# EasyEDA Pro project ChisFlash-MBC5_GBC烧录卡_shn修改plus图纸nds烧录线路+电池加固通孔.epro, board ChisFlash-MBC5-v1.1
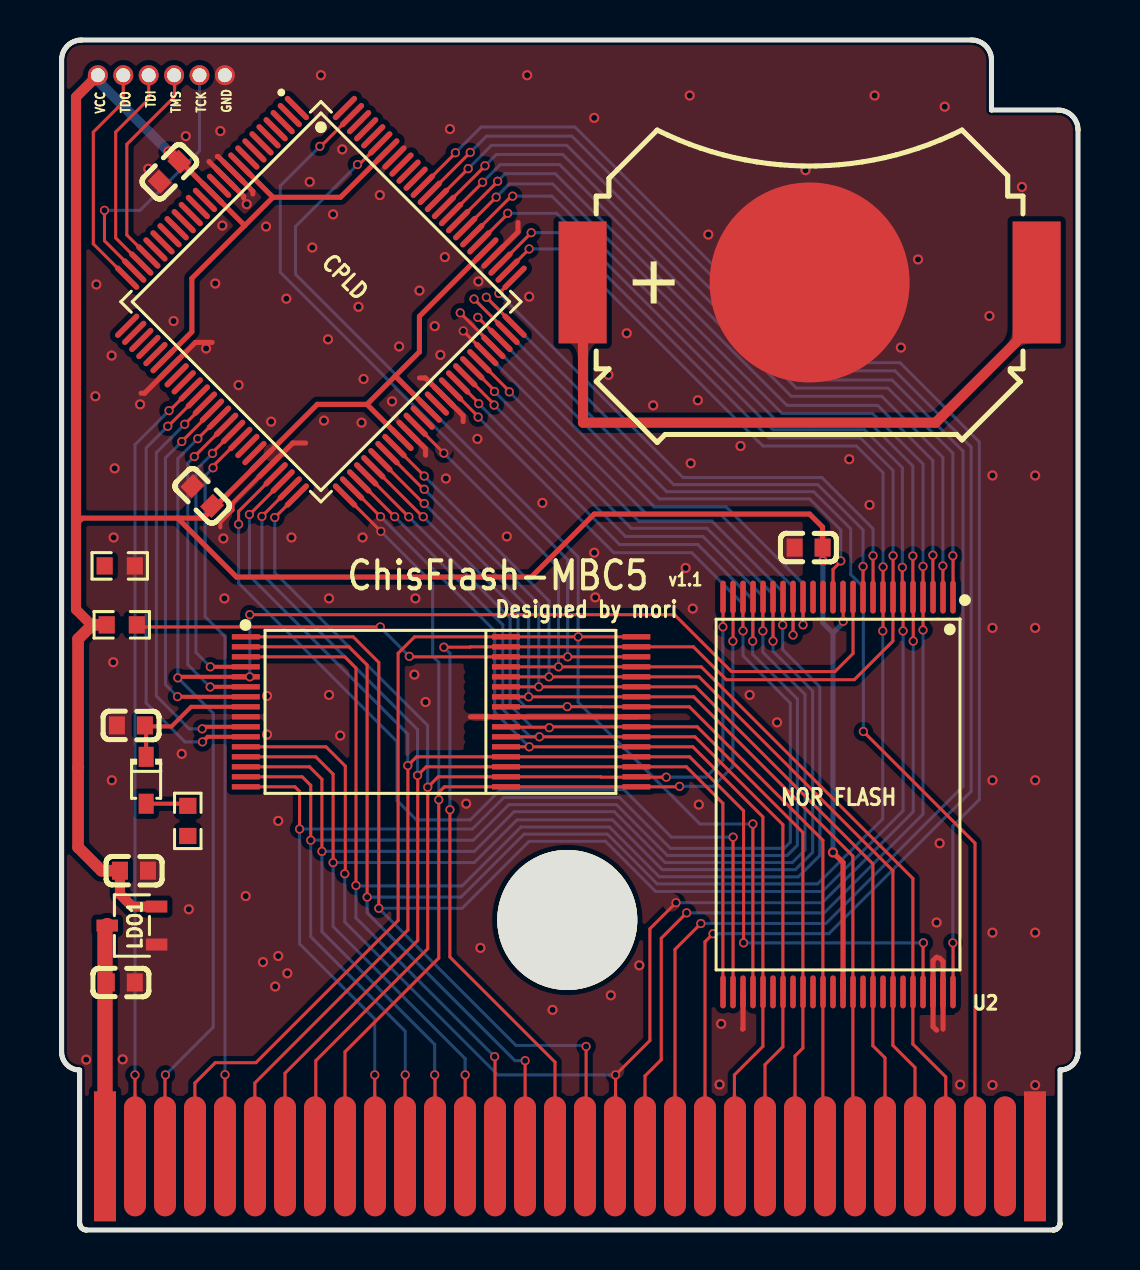
[diagram p2: board, top side]
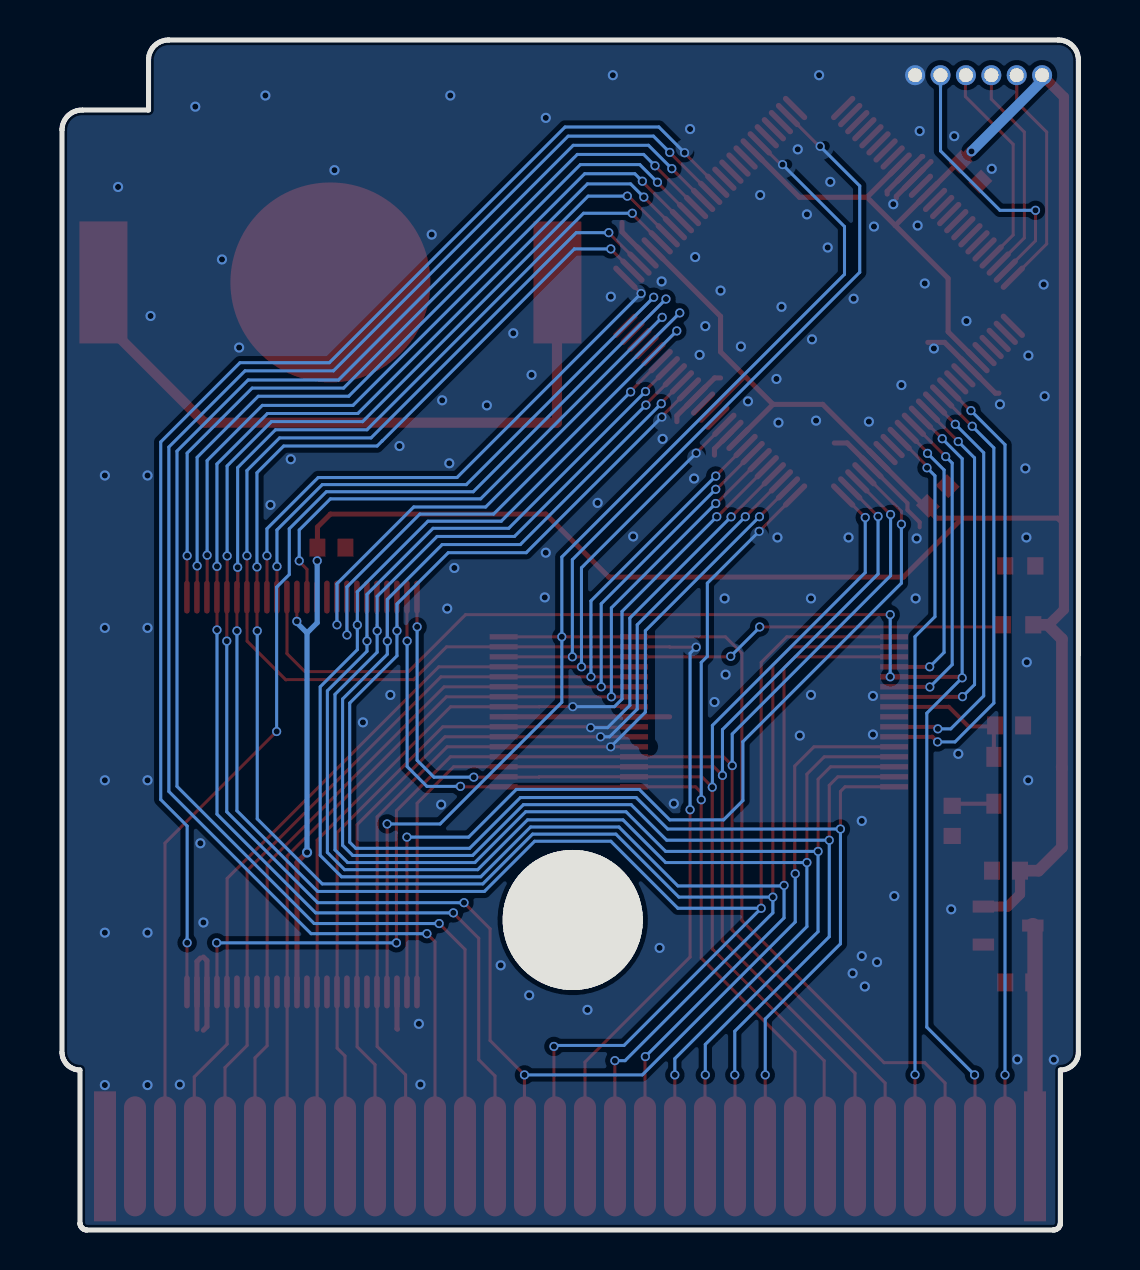
[diagram p3: board, bottom side, seen from below]

Outline 50.82 x 59.5 mm; copper layers: Top Layer, Bottom Layer. Coordinates in mm from the lower left corner of the outline.
Stack: Top Layer 0.035mm / Dielectric1 1.51mm FR4 er 4.5 / Bottom Layer 0.035mm

## Design rules (mm)
template: 自定义配置
spacing copperThickness1oz (default): track to track 0.102, other pairs 0.152 to 0.152
spacing copperThickness2oz: track to track 0.203, other pairs 0.152 to 0.3
track width copperThickness1oz (default): min 0.152, default 0.152, max 2.54
track width copperThickness2oz: min 0.203, default 0.254, max 2.54
differential pair differentialPair (default): width min 0.127, default 0.254, max 2.54; gap min 0.152, default 0.152
via viaSize (default): diameter min 0.406, default 0.457, max 10; hole min 0.3, default 0.305, max 6.299

## Placement (name value [footprint] x y rotation side)
BT1  MY-2032-12  [BAT-SMD_MY-2032-12]  37.4 47.38 180 top
C1  100nF  [C0603]  3.47 25.23 180 top
C2  100nF  [C0603]  37.35 34.12 0 top
C3  10uF  [C0603]  3.62 17.97 180 top
C5  100nF  [C0603]  7.03 36.7 315 top
C6  100nF  [C0603]  5.4 52.92 45 top
C7  10uF  [C0603]  2.96 12.38 180 top
D2  1N4148WS  [SOD-323_L1.8-W1.3-LS2.5-RD]  4.23 22.49 270 top
J1  GAMEBOY-CARTRIDGE-MBC3  [GAMEBOY_CARTRIDGE_PIN]  25.28 15.5 0 top
LDO1  ME6209A33M3G  [SOT-23-3_L2.9-W1.6-P1.90-LS2.8-BR]  3.52 15.22 0 top
R1  100kΩ  [R0603]  2.91 33.21 0 top
R2  10kΩ  [R0603]  6.31 20.46 90 top
R3  10kΩ  [R0603]  3.01 30.26 180 top
U2  MX29LV640ETTI-70G  [TSOP-48_L12.0-W18.4-P0.50-LS20.0-BL]  38.82 21.78 180 top
U4  EPM240T100C5N  [TQFP-100_L14.0-W14.0-P0.50-LS16.0-BL]  12.96 46.42 225 top
U6  SRAM&FRAM  [TSSOP-TSOP二合一]  19.98 25.89 180 top
XP1  JTAG  [HDR-TH_6P-P1.27-V-M-1]  4.99 57.74 0 top

## Footprints (pads in the part's own frame, mm; a bottom-side part is the same pattern mirrored in y, then rotated)
BAT-SMD_MY-2032-12
  rect 2.4x6.1 smd: 1(-11.35,0) 1(11.35,0)
  round 10 smd: 2(0,0)
C0603
  rect 0.8x0.9 smd: 1(-0.7,0) 2(0.7,0)
GAMEBOY_CARTRIDGE_PIN
  round 7 hole 7: 0(0,0)
  rect 1.1x6.5 smd: 1(-23.114,-11.819) 32(23.386,-11.819)
  oval 1.1x6 smd: 2(-21.614,-11.819) 3(-20.114,-11.819) 4(-18.614,-11.819) 5(-17.114,-11.819) 6(-15.614,-11.819) 7(-14.114,-11.819) 8(-12.614,-11.819) 9(-11.114,-11.819) 10(-9.614,-11.819) 11(-8.114,-11.819) 12(-6.614,-11.819) 13(-5.114,-11.819) 14(-3.614,-11.819) 15(-2.114,-11.819) 16(-0.614,-11.819) 17(0.886,-11.819) 18(2.386,-11.819) 19(3.886,-11.819) 20(5.386,-11.819) 21(6.886,-11.819) 22(8.386,-11.819) 23(9.886,-11.819) 24(11.386,-11.819) 25(12.886,-11.819) 26(14.386,-11.819) 27(15.886,-11.819) 28(17.386,-11.819) 29(18.886,-11.819) 30(20.386,-11.819) 31(21.886,-11.819)
HDR-TH_6P-P1.27-V-M-1
  round 1 hole 0.7: 1(-3.175,0) 2(-1.905,0) 3(-0.635,0) 4(0.635,0) 5(1.905,0) 6(3.175,0)
R0603
  rect 0.806x0.864 smd: 1(-0.753,0) 2(0.753,0)
SOD-323_L1.8-W1.3-LS2.5-RD
  rect 1x0.75 smd: 1(-1.173,0) 2(1.173,0)
SOT-23-3_L2.9-W1.6-P1.90-LS2.8-BR
  rect 1.07x0.6 smd: 1(1.235,-0.95) 2(1.235,0.95) 3(-1.235,0)
TQFP-100_L14.0-W14.0-P0.50-LS16.0-BL
  oval 0.28x1.6 smd: 1(-6,-7.7) 2(-5.5,-7.7) 3(-5,-7.7) 4(-4.5,-7.7) 5(-4,-7.7) 6(-3.5,-7.7) 7(-3,-7.7) 8(-2.5,-7.7) 9(-2,-7.7) 10(-1.5,-7.7) 11(-1,-7.7) 12(-0.5,-7.7) 13(0,-7.7) 14(0.5,-7.7) 15(1,-7.7) 16(1.5,-7.7) 17(2,-7.7) 18(2.5,-7.7) 19(3,-7.7) 20(3.5,-7.7) 21(4,-7.7) 22(4.5,-7.7) 23(5,-7.7) 24(5.5,-7.7) 25(6,-7.7) 51(6,7.7) 52(5.5,7.7) 53(5,7.7) 54(4.5,7.7) 55(4,7.7) 56(3.5,7.7) 57(3,7.7) 58(2.5,7.7) 59(2,7.7) 60(1.5,7.7) 61(1,7.7) 62(0.5,7.7) 63(0,7.7) 64(-0.5,7.7) 65(-1,7.7) 66(-1.5,7.7) 67(-2,7.7) 68(-2.5,7.7) 69(-3,7.7) 70(-3.5,7.7) 71(-4,7.7) 72(-4.5,7.7) 73(-5,7.7) 74(-5.5,7.7) 75(-6,7.7)
  oval 1.6x0.28 smd: 26(7.7,-6) 27(7.7,-5.5) 28(7.7,-5) 29(7.7,-4.5) 30(7.7,-4) 31(7.7,-3.5) 32(7.7,-3) 33(7.7,-2.5) 34(7.7,-2) 35(7.7,-1.5) 36(7.7,-1) 37(7.7,-0.5) 38(7.7,0) 39(7.7,0.5) 40(7.7,1) 41(7.7,1.5) 42(7.7,2) 43(7.7,2.5) 44(7.7,3) 45(7.7,3.5) 46(7.7,4) 47(7.7,4.5) 48(7.7,5) 49(7.7,5.5) 50(7.7,6) 76(-7.7,6) 77(-7.7,5.5) 78(-7.7,5) 79(-7.7,4.5) 80(-7.7,4) 81(-7.7,3.5) 82(-7.7,3) 83(-7.7,2.5) 84(-7.7,2) 85(-7.7,1.5) 86(-7.7,1) 87(-7.7,0.5) 88(-7.7,0) 89(-7.7,-0.5) 90(-7.7,-1) 91(-7.7,-1.5) 92(-7.7,-2) 93(-7.7,-2.5) 94(-7.7,-3) 95(-7.7,-3.5) 96(-7.7,-4) 97(-7.7,-4.5) 98(-7.7,-5) 99(-7.7,-5.5) 100(-7.7,-6)
TSOP-48_L12.0-W18.4-P0.50-LS20.0-BL
  oval 0.28x1.65 smd: 1(-5.75,-9.87) 2(-5.25,-9.87) 3(-4.75,-9.87) 4(-4.25,-9.87) 5(-3.75,-9.87) 6(-3.25,-9.87) 7(-2.75,-9.87) 8(-2.25,-9.87) 9(-1.75,-9.87) 10(-1.25,-9.87) 11(-0.75,-9.87) 12(-0.25,-9.87) 13(0.25,-9.87) 14(0.75,-9.87) 15(1.25,-9.87) 16(1.75,-9.87) 17(2.25,-9.87) 18(2.75,-9.87) 19(3.25,-9.87) 20(3.75,-9.87) 21(4.25,-9.87) 22(4.75,-9.87) 23(5.25,-9.87) 24(5.75,-9.87) 25(5.75,9.87) 26(5.25,9.87) 27(4.75,9.87) 28(4.25,9.87) 29(3.75,9.87) 30(3.25,9.87) 31(2.75,9.87) 32(2.25,9.87) 33(1.75,9.87) 34(1.25,9.87) 35(0.75,9.87) 36(0.25,9.87) 37(-0.25,9.87) 38(-0.75,9.87) 39(-1.25,9.87) 40(-1.75,9.87) 41(-2.25,9.87) 42(-2.75,9.87) 43(-3.25,9.87) 44(-3.75,9.87) 45(-4.25,9.87) 46(-4.75,9.87) 47(-5.25,9.87) 48(-5.75,9.87)
TSSOP-TSOP二合一
  rect 1.399x0.27 smd: 1(10.762,-3.769) 2(10.762,-3.269) 3(10.762,-2.769) 4(10.762,-2.269) 5(10.762,-1.769) 6(10.762,-1.269) 7(10.762,-0.769) 8(10.762,-0.269) 9(10.762,0.231) 10(10.762,0.731) 11(10.762,1.231) 12(10.762,1.731) 13(10.762,2.231) 14(10.762,2.731) 15(10.762,3.231) 16(10.762,3.731) 17(-8.763,3.731) 17(-2.243,3.731) 18(-8.763,3.231) 18(-2.243,3.231) 19(-8.763,2.731) 19(-2.243,2.731) 20(-8.763,2.231) 20(-2.243,2.231) 21(-8.763,1.731) 21(-2.243,1.731) 22(-8.763,1.231) 22(-2.243,1.231) 23(-8.763,0.731) 23(-2.243,0.731) 24(-8.763,0.231) 24(-2.243,0.231) 25(-8.763,-0.269) 25(-2.243,-0.269) 26(-8.763,-0.769) 26(-2.243,-0.769) 27(-8.763,-1.269) 27(-2.243,-1.269) 28(-8.763,-1.769) 28(-2.243,-1.769) 29(-8.763,-2.269) 29(-2.243,-2.269) 30(-8.763,-2.769) 30(-2.243,-2.769) 31(-8.763,-3.269) 31(-2.243,-3.269) 32(-8.763,-3.769) 32(-2.243,-3.769)

## Nets
As in the schematic.

Pads without a net: J1 0 31; U4 1 2 3 4 5 6 7 8 12 14 15 16 17 18 19 20 21 26 27 28 29 30 33 34 43 44 62 64 90 91 92 96 97 98 100

## Via types
v1: diameter 0.508, hole 0.305, Top Layer to Bottom Layer, 113 vias
v2: diameter 0.457, hole 0.305, Top Layer to Bottom Layer, 130 vias

## Routing (per net, layer and track width the routed paths; a pad name or vN(x,y) marks a point on that pad's centre or on a via; arc(x,y) is an arc through that point)
+3V3: length 168.9
  Top Layer w0.152: U2.12 39.08,31.64 v2(39.08,30.44)
  Top Layer w0.254: 15.27,41.28 12.78,41.28 U4.45 7.09,35.59 5.8,35.59 ; 15.27,41.28 16.68,42.7 ; 15.27,41.28 U4.59 ; 5.8,35.59 1.04,35.59 0.72,35.28 ; 5.8,35.59 8.75,32.65 23.48,32.65 26.63,35.8 37.4,35.8 38.05,35.15 C2.2 38.06,34.11 v2(38.06,33.46) ; 9.15,50.23 10.57,51.64 ; 9.15,50.23 U4.13 5.97,53.41 C6.2 ; 9.15,50.23 6.51,47.58 6.51,44.91 U4.31 ; 10.57,51.64 13.95,51.64 U4.94 ; 10.57,51.64 U4.9 ; 21.24,49.03 17.89,45.69 17.89,43.91 16.68,42.7 ; v1(38.57,18.88) 39.07,18.38 U2.37 ; 16.68,42.7 U4.63
  Top Layer w0.508: XP1.1 0.72,56.65 0.72,31.02 1.48,30.26 1.54,30.26 ; 0.87,23.15 0.82,23.1 ; C6.2 5.37,53.93 v2(5.34,53.93) ; LDO1.2 3.53,16.17 2.92,16.79 2.92,17.97
  Top Layer w0.584: 1.81,30.26 1.54,30.26 0.82,29.55 0.82,19.14 1.99,17.97 2.92,17.97
  Bottom Layer w0.254: v2(39.08,30.44) 39.08,30.36 38.57,29.85 ; 38.57,29.85 38.06,30.36 v2(38.06,33.46) ; 38.57,29.85 v1(38.57,18.88)
  Bottom Layer w0.508: v2(5.34,53.93) 1.81,57.46 XP1.1
+5V: length 11.6
  Top Layer w0.762: J1.1 2.17,15.11 LDO1.3
GND: length 40.7
  Top Layer w0.203: U4.46 8.55,36.34 8.55,36 7.94,35.39 7.94,35.14
  Top Layer w0.254: U4.60 18.2,39.06 18.2,38.74 ; 9.1,51.6 9.1,51.69 U4.11 7.38,53.42 7.38,53.43 ; 7.78,53.68 7.82,53.68 U4.10 9.56,51.94 9.56,51.8 ; 12.2,39.35 11.56,39.35 U4.46 ; 7.53,44.38 6.69,44.38 U4.32 4.15,41.84 3.97,41.84 ; 43.9,13.6 44.07,13.43 U2.47 44.07,10.04 ; U6.24 20.44,25.66 ; U4.79 22.82,49.91 22.82,50.38 ; 20.08,40.42 20.08,40.72 U4.65 18.19,42.61 17.89,42.61 ; U2.27 34.07,10.07 34.05,10.04 ; 43.75,13.65 43.57,13.47 U2.46 43.57,10.17 43.75,9.99
  vias: v1(1.23,8.52) v1(1.69,41.69) v1(1.74,47.28) v1(2.5,43.72) v1(2.51,22.49) v1(2.6,34.63) v1(2.58,28.39) v1(2.65,38.08) v1(3.05,8.53) v1(3.92,41.28) v1(4.33,53.06) v1(5.6,45.45) v1(6.01,23.81) v1(6.21,54.7) v1(6.36,16.04) v1(7.22,44.08) v1(7.68,47.33) v1(7.94,54.95) v1(8.04,50.23) v1(8.09,34.58) v1(8.14,31.58) v1(8.85,42.25) v1(9.21,16.7) v1(9.26,51.29) v1(10.07,13.4) v1(10.22,50.17) v1(10.27,26.7) v1(10.27,24.77) v1(10.48,40.42) v1(10.68,12.18) v1(10.83,20.46) v1(10.83,13.7) v1(11.24,46.57) v1(11.29,12.84) v1(11.49,34.63) v1(12.41,52.41) v1(12.53,49.13) v1(12.96,57.74) v1(13.12,40.47) v1(13.32,44.54) v1(13.37,31.58) v1(13.37,26.76) v1(13.57,50.78) v1(13.93,24.72) v1(14.03,54.04) v1(14.84,46.16) v1(15,40.37) v1(15.1,42.55) v1(15.05,34.63) v1(15.91,51.75) v1(16.52,41.44) v1(16.88,44.18) v1(17.69,31.58) v1(17.64,27.77) v1(17.89,46.97) v1(18.2,26.4) v1(18.66,45.2) v1(18.94,43.76) v1(19.16,48.65) v1(19.21,37.58) v1(19.42,55.05) v1(20.23,21.32) v1(20.79,39.56) v1(20.84,47.43) v1(20.94,14.11) v1(22.26,34.68) v1(23.28,57.74) v1(23.38,46.67) v1(24.04,36.36) v1(24.55,11.01) v1(26.63,55.61) v1(26.63,33.87) v1(26.68,31.63) v1(27.34,42.76) v1(27.46,11.74) v1(28.26,44.84) v1(28.89,13.23) v1(29.58,41.23) v1(31.2,33.11) v1(31.41,56.73) v1(31.46,38.34) v1(31.56,31.07) v1(31.81,41.49) v1(31.86,21.27) v1(32.34,49.77) v1(32.9,7.27) v1(32.98,10.31) v1(33.95,39.2) v1(34.4,26.76) v1(35.77,25.38) v1(37.2,52.99) v1(39.38,38.54) v1(40.4,36.26) v1(40.65,56.73) v1(41.96,44.12) v1(42.82,48.53) v1(43.75,15.38) v1(43.9,19.34) v1(44.16,56.17) v1(44.93,7.27) v1(46.39,45.7) v1(46.54,37.73) v1(46.54,30.11) v1(46.54,22.49) v1(46.54,14.87) v1(46.54,7.25) v1(48.02,52.16) v1(48.68,37.73) v1(48.68,30.11) v1(48.68,22.49) v1(48.68,14.87) v1(48.68,7.25)
A0: length 77
  Top Layer w0.152: U2.45 43.07,14.34 v2(43.09,14.36) ; v2(9.39,35.78) 9.4,35.78 11.06,37.43 ; v2(34.1,14.36) 34.1,20.96 31.4,23.66 17.75,23.66 v2(17.31,23.22) 17.32,23.21 17.32,15 9.66,7.35 9.66,3.69 J1.6
  Bottom Layer w0.152: v2(9.39,35.78) 9.39,32.72 17.31,24.8 v2(17.31,23.22) ; v2(34.1,14.36) v2(43.09,14.36)
A1: length 65.6
  Top Layer w0.152: v2(10.02,35.68) 10.02,35.69 U4.49 ; U2.25 33.06,11.92 33.06,21.34 31.24,23.16 18.23,23.16 v2(17.8,22.73) 17.81,22.72 17.81,14.48 11.17,7.84 J1.7
  Bottom Layer w0.152: v2(10.02,35.68) 10.02,32.8 17.8,25.02 v2(17.8,22.73)
A2: length 62.6
  Top Layer w0.152: J1.8 12.71,3.73 12.71,8.47 18.31,14.06 v2(18.31,22.14) 18.83,22.66 26.96,22.66 26.98,22.64 v2(30.23,22.64) ; U4.50 10.66,35.63 v2(10.66,35.63) ; v2(33.06,30.16) 33.07,30.17 U2.24
  Bottom Layer w0.152: 18.3,22.07 18.3,25.23 10.66,32.87 v2(10.66,35.63) ; v2(30.23,22.64) 32.22,22.64 33.06,23.49 v2(33.06,30.16)
A3: length 61
  Top Layer w0.152: U2.23 33.57,29.46 v2(33.56,29.45) ; J1.9 14.17,8.91 18.86,13.6 v2(18.86,21.51) 18.86,21.88 19.14,22.16 30.87,22.16 v2(30.9,22.18) ; v2(15.96,34.93) 14.17,36.73
  Bottom Layer w0.152: v2(15.96,34.93) 18.55,32.34 18.55,28.69 18.86,28.38 v2(18.86,21.51) ; v2(30.9,22.18) 32.57,22.18 33.56,23.17 v2(33.56,29.45)
A4: length 82.9
  Top Layer w0.152: 8.91,22.16 11.67,22.16 11.9,21.93 v2(11.9,20.05) ; 34.06,31.68 34.06,29.97 v2(34.07,29.96) ; U4.66 20.83,40.67 v2(20.83,40.65) ; v2(15.66,7.76) 15.66,3.7 J1.10
  Bottom Layer w0.152: v2(20.83,40.65) 27.61,33.87 31.51,33.87 34.07,31.3 v2(34.07,29.96) 34.07,28.71 36.43,26.35 36.43,19.39 36.13,19.08 30.44,19.08 27.9,21.62 22.11,21.62 20.53,20.05 v2(11.9,20.05) 11.9,14.31 15.66,10.55 v2(15.66,7.76)
A5: length 85.3
  Top Layer w0.152: v2(17.18,7.76) 17.17,7.74 J1.11 ; v2(20.86,41.32) 20.86,41.35 19.82,42.38 ; v2(34.55,29.45) 34.56,29.46 34.56,31.68 ; v2(12.46,19.49) 12.46,22.23 12.03,22.66 8.91,22.66
  Bottom Layer w0.152: v2(20.86,41.32) 27.9,34.27 31.81,34.27 34.55,31.53 v2(34.55,29.45) 34.55,28.79 36.79,26.55 36.79,19.24 36.28,18.73 30.29,18.73 27.75,21.27 22.36,21.27 20.58,19.49 v2(12.46,19.49) 12.46,14.67 17.18,9.94 v2(17.18,7.76)
A6: length 86.6
  Top Layer w0.152: U4.68 21.62,41.29 v2(21.62,41.25) ; v2(18.65,7.76) 18.67,7.74 J1.12 ; v2(13.02,18.93) 13.02,22.54 12.39,23.16 8.91,23.16 ; v2(35.06,29.96) 35.06,31.68
  Bottom Layer w0.152: v2(18.65,7.76) 18.65,9.28 13.02,14.92 v2(13.02,18.93) 20.64,18.93 22.62,20.91 27.64,20.91 30.18,18.37 36.54,18.37 37.17,19.01 37.17,26.78 35.06,28.89 v2(35.06,29.96) 35.06,31.68 32.07,34.68 28.19,34.68 v2(21.62,41.25)
A7: length 88.8
  Top Layer w0.152: v2(13.57,18.37) 13.57,22.79 12.71,23.66 8.91,23.66 ; v2(35.57,29.45) 35.57,31.67 35.56,31.68 ; v2(21.64,41.93) 21.64,41.98 U4.69 ; v2(20.18,7.76) 20.18,3.69 J1.13
  Bottom Layer w0.152: v2(21.64,41.93) 28.48,35.09 32.27,35.09 35.57,31.78 v2(35.57,29.45) 35.57,28.94 37.55,26.96 37.55,18.88 36.69,18.02 30.03,18.02 27.54,20.51 22.77,20.51 20.64,18.37 v2(13.57,18.37) 13.57,15.17 20.18,8.57 v2(20.18,7.76)
A8: length 94.6
  Top Layer w0.152: 8.91,28.66 14.16,28.66 14.72,28.1 v2(14.72,17.23) ; U4.70 22.39,41.94 v2(22.39,41.91) ; J1.14 21.67,8.65 v2(21.65,8.67) ; v2(36.05,30.25) 36.05,31.66
  Bottom Layer w0.152: v2(21.65,8.67) 14.72,15.6 v2(14.72,17.23) 14.74,17.21 20.03,17.21 22.97,20.15 27.39,20.15 29.88,17.66 36.84,17.66 37.91,18.73 37.91,27.16 36.05,29.02 v2(36.05,30.25) 36.05,31.91 32.52,35.44 28.86,35.44 v2(22.39,41.91)
A9: length 105.5
  Top Layer w0.152: v2(15.28,16.65) 15.28,28.25 14.37,29.16 8.91,29.16 ; v2(23.18,8.47) 23.18,3.69 J1.15 ; 41.07,29.96 U2.8 v2(41.07,33.16) ; U4.77 23.38,49.05 v2(23.38,49.06) ; v2(41.06,29.96) 41.06,29.96
  Bottom Layer w0.152: v2(41.07,33.16) 41.07,37.87 39.74,39.2 35.06,39.2 34.81,39.46 34.81,39.46 25.2,49.06 v2(23.38,49.06) ; v2(41.06,29.96) 41.06,20.56 37.81,17.31 29.78,17.31 27.29,19.8 23.12,19.8 19.98,16.65 v2(15.28,16.65) 15.28,15.86 22.67,8.47 v2(23.18,8.47)
A10: length 85.5
  Top Layer w0.152: v2(19.42,21.02) 19.42,13.65 24.67,8.4 J1.16 ; U4.78 23.48,49.86 v2(23.48,49.87) ; v2(19.11,29.14) 20.42,29.14 20.44,29.16 U6.31 U6.31 31.59,29.16 33.23,27.52 39.63,27.52 41.57,29.45 U2.7 ; 41.57,31.68 U2.7 ; 41.57,31.68 v2(41.57,33.72) ; 41.57,31.68 U2.7
  Bottom Layer w0.152: v2(41.57,33.72) 41.57,37.98 39.94,39.61 35.37,39.61 25.11,49.87 v2(23.48,49.87) ; v2(19.42,21.02) 19.42,28.84 v2(19.11,29.14)
A11: length 112.6
  Top Layer w0.152: v2(22.31,50.84) 22.31,50.81 20.88,49.39 ; v2(42.07,29.96) 42.07,31.67 42.06,31.68 ; J1.17 26.22,3.74 v2(26.22,9.18) ; 8.91,29.66 14.58,29.66 15.86,28.38 v2(15.86,16.09) ; v2(42.04,33.14) 42.03,33.13 42.03,32.14
  Bottom Layer w0.152: v2(22.31,50.84) 24.74,50.84 35.57,40.01 40.14,40.01 42.04,38.12 v2(42.04,33.14) ; v2(42.07,29.96) 42.07,20.96 38.04,16.93 29.7,16.93 27.19,19.44 23.38,19.44 20.03,16.09 v2(15.86,16.09) 22.72,9.23 26.17,9.23 v2(26.22,9.18)
A12: length 103.3
  Top Layer w0.152: v2(42.56,33.71) 42.56,31.68 ; U2.5 42.58,31.64 v2(42.58,29.45) ; U4.82 22.49,51.7 v2(22.55,51.7) ; v2(14.16,17.81) 14.18,17.84 14.18,23.2 13.22,24.16 U6.12 ; J1.18 27.7,3.71 v2(27.7,7.76) 29.42,9.47 29.42,15.06 v2(30.72,16.37)
  Bottom Layer w0.152: v2(42.58,29.45) 42.58,20.91 38.03,16.37 v2(30.72,16.37) ; v2(27.7,7.76) 21.8,7.76 14.16,15.4 v2(14.16,17.81) ; v2(42.56,33.71) 42.56,38.2 40.35,40.42 35.79,40.42 24.51,51.7 v2(22.55,51.7)
A13: length 74
  Top Layer w0.152: v2(31.25,15.86) 29.98,14.59 29.98,8.52 29.17,7.71 J1.19 ; U4.83 21.73,51.64 v2(21.73,51.65) ; 43.07,30 U2.4 ; 43.06,31.68 43.07,31.69 v2(43.07,33.18)
  Bottom Layer w0.152: v2(43.07,33.18) 43.07,38.3 40.55,40.83 36.03,40.83 24.55,52.31 22.39,52.31 v2(21.73,51.65) ; v2(31.25,15.86) 38.14,15.86 43.07,20.79 v2(43.07,30)
A14: length 78.7
  Top Layer w0.152: J1.20 30.67,14.03 v2(31.96,15.33) ; U4.87 v2(20.33,53.07)
  Bottom Layer w0.152: v2(31.96,15.33) 38.21,15.33 45.07,22.18 45.07,38.95 41.51,42.5 36.99,42.5 25.26,54.24 21.5,54.24 v2(20.33,53.07)
A15: length 79
  Top Layer w0.152: J1.21 32.17,14.41 v2(32.57,14.82) ; 20.43,53.88 18.41,51.86
  Bottom Layer w0.152: v2(32.57,14.82) 38.36,14.82 45.48,21.93 45.48,39.15 41.67,42.96 37.25,42.96 25.51,54.7 21.25,54.7 v2(20.43,53.88)
BT+: length 34.6
  Top Layer w0.508: BT1.1 26.05,47.79 26.07,47.77 26.07,40.37 43.7,40.37 48.75,45.42 BT1.1
CE2: length 16.2
  Top Layer w0.152: 8.23,40.26 8.22,40.26 v2(6.63,38.67)
  Top Layer w0.203: 7.43,27.15 7.43,27.16 U6.6
  Bottom Layer w0.152: v2(7.43,27.15) 6.31,28.27 6.31,38.35 v2(6.63,38.67)
CLK: length 39.5
  Top Layer w0.152: v2(5.37,40.97) 5.4,40.97 U4.35 ; J1.2 v2(3.67,7.76)
  Bottom Layer w0.152: v2(5.37,40.97) 3.67,39.27 v2(3.67,7.76)
CS: length 37
  Top Layer w0.152: 8.92,39.54 7.57,38.2 v2(7.57,38.11) ; J1.5 v2(8.17,7.77)
  Bottom Layer w0.152: v2(7.57,38.11) 7.17,37.72 7.17,30.67 8.17,29.67 v2(8.17,7.77)
D0: length 48.5
  Top Layer w0.152: J1.22 33.64,3.71 33.64,7.76 35.06,9.18 35.06,20.66 31.56,24.16 U6.21 v2(23.38,24.16) U6.21 ; v2(15.95,35.67) 14.49,37.12 14.48,37.12
  Bottom Layer w0.152: v2(15.95,35.67) 21.65,29.96 21.65,25.89 v2(23.38,24.16)
D1: length 49.5
  Top Layer w0.152: U6.22 v2(23.89,24.66) U6.22 31.67,24.66 36.06,20.27 36.06,9.16 35.17,8.27 J1.23 ; 14.83,37.47 14.85,37.47 v2(16.65,35.67)
  Bottom Layer w0.152: v2(16.65,35.67) 22.06,30.26 22.06,26.04 23.44,24.66 v2(23.89,24.66)
D2: length 50.4
  Top Layer w0.152: v2(17.36,35.66) 17.35,35.66 15.19,37.83 ; J1.24 36.67,8.7 37.06,9.1 37.06,19.88 31.78,25.16 U6.23 24.43,25.16 v2(24.39,25.12) 24.36,25.14 22.24,25.14 U6.23
  Bottom Layer w0.152: v2(17.36,35.66) 22.43,30.6 22.43,26.23 23.54,25.12 v2(24.39,25.12)
D3: length 51.7
  Top Layer w0.152: 15.54,38.18 18.05,35.67 v2(18.08,35.67) ; J1.25 38.06,3.79 38.06,19.49 31.39,26.16 U6.25 26.96,26.16 26.95,26.17 v2(25.28,26.17) 22.23,26.17 U6.25
  Bottom Layer w0.152: v2(25.28,26.17) 23.2,26.17 22.82,26.55 22.82,30.93 v2(18.08,35.67)
D4: length 51
  Top Layer w0.152: 15.89,38.53 18.1,36.33 v2(18.13,36.33) ; J1.26 39.56,3.79 39.56,18.7 31.6,26.66 v2(23.35,26.66) 21.91,26.66
  Bottom Layer w0.152: v2(18.13,36.33) 23.35,31.11 v2(23.35,26.66)
D5: length 52.1
  Top Layer w0.152: v2(18.13,37.04) 18.1,37.04 16.25,38.89 ; 21.91,27.16 v2(23.86,27.16) 31.71,27.16 40.56,18.31 40.56,9.22 41.17,8.61 J1.27
  Bottom Layer w0.152: v2(23.86,27.16) 23.86,31.31 v2(18.13,37.04)
D6: length 53.2
  Top Layer w0.152: 21.91,27.66 v2(24.37,27.66) 31.87,27.66 41.56,17.97 41.56,9.23 42.67,8.12 J1.28 ; 16.6,39.24 18.13,37.71 v2(18.13,37.7)
  Bottom Layer w0.152: v2(24.37,27.66) 24.37,31.46 v2(18.13,37.7)
D7: length 54.7
  Top Layer w0.152: J1.29 44.21,3.72 44.21,7.65 42.56,9.3 42.56,17.58 31.98,28.16 v2(24.85,28.16) 21.91,28.16 ; v2(19.11,38.85) 17.68,40.28
  Bottom Layer w0.152: 24.85,28.85 24.85,33.11 v2(19.11,38.85) ; 24.85,28.47 24.85,28.85 ; v2(24.85,28.16) 24.85,28.47
RAM_A13: length 14.6
  Top Layer w0.152: v2(7.54,38.83) 7.54,38.88 8.56,39.89
  Top Layer w0.203: v2(7.43,28.16) U6.4
  Bottom Layer w0.152: v2(7.54,38.83) 6.72,38.01 6.72,28.88 v2(7.43,28.16)
RAM_A14: length 22.3
  Top Layer w0.152: U4.36 5.33,40.19 v2(5.31,40.19)
  Top Layer w0.203: U6.11 7.3,24.66 v2(7.04,24.41)
  Bottom Layer w0.152: v2(5.31,40.19) 4.23,39.11 4.23,26.35 6.17,24.41 v2(7.04,24.41)
RAM_A15: length 18.9
  Top Layer w0.152: U4.38 7.52,40.94 v2(6.01,39.42)
  Top Layer w0.203: v2(5.79,26.67) 5.8,26.66 U6.7
  Bottom Layer w0.152: v2(5.79,26.67) 5.19,27.27 5.19,38.61 v2(6.01,39.42)
RAM_A16: length 20.8
  Top Layer w0.152: U4.37 7.17,41.3 v2(6.15,40.29)
  Top Layer w0.203: v2(7.03,25.06) 7.13,25.16 U6.10
  Bottom Layer w0.152: v2(7.03,25.06) 6.38,25.06 4.74,26.7 4.74,38.87 v2(6.15,40.29)
RAM_CS: length 60.2
  Top Layer w0.152: v2(12.91,54.19) 12.96,54.19 U4.99 ; v2(17.38,28.69) 17.41,28.66 v2(25.3,28.66) U6.30 ; v2(15.94,30.16) 3.87,30.16 R3.1
  Bottom Layer w0.152: v2(17.38,28.69) 15.94,30.14 v2(15.94,30.16) ; v2(25.3,28.66) 25.3,33.52 10.93,47.89 10.93,52.21 v2(12.91,54.19)
RD: length 98.1
  Top Layer w0.152: v2(14.79,53.27) 14.87,53.27 U4.95 ; U2.28 34.56,11.92 v2(34.56,20.3) ; U6.32 v2(25.83,29.66) 17.65,29.66 16.83,28.84 16.83,15.48 9.71,8.37 7.68,8.37 6.67,7.35 6.67,3.69 J1.4
  Bottom Layer w0.152: v2(34.56,20.3) 31.91,20.3 25.83,26.39 v2(25.83,29.66) 25.83,33.65 11.69,47.79 11.69,50.17 v2(14.79,53.27)
ROM_A14: length 37.5
  Top Layer w0.152: v2(21.8,52.44) 21.8,52.42 19.82,50.45 ; v2(43.56,33.74) 43.56,31.68
  Bottom Layer w0.152: v2(21.8,52.44) 22.18,52.82 24.69,52.82 36.27,41.23 40.8,41.23 43.56,38.47 v2(43.56,33.74)
ROM_A15: length 38.6
  Top Layer w0.152: 44.06,31.68 v2(44.06,33.21) ; 19.47,50.8 21.05,52.38 v2(21.05,52.39)
  Bottom Layer w0.152: v2(21.05,52.39) 21.93,53.27 24.9,53.27 36.48,41.69 41.01,41.69 44.06,38.63 v2(44.06,33.21)
ROM_A16: length 39.9
  Top Layer w0.152: v2(44.56,33.72) 44.57,33.71 U2.1 ; v2(21.17,53.21) 21.17,53.21 U4.86
  Bottom Layer w0.152: v2(21.17,53.21) 21.74,53.78 25.06,53.78 36.74,42.1 41.31,42.1 44.56,38.85 v2(44.56,33.72)
ROM_A17: length 63.6
  Top Layer w0.152: v2(19.69,53.87) 19.69,53.85 U4.89 ; U2.48 44.57,14.35 v2(44.56,14.36)
  Bottom Layer w0.152: v2(19.69,53.87) 20.98,55.15 25.66,55.15 37.45,43.37 41.92,43.37 45.88,39.4 45.88,21.52 44.56,20.2 v2(44.56,14.36)
ROM_A18: length 27.7
  Top Layer w0.152: 21.24,43.8 20.08,44.96 ; U2.17 v2(36.57,29.75)
  Bottom Layer w0.152: v2(36.57,29.75) 36.57,32.15 32.93,35.8 29.24,35.8 v2(20.08,44.96)
ROM_A19: length 28.6
  Top Layer w0.152: U4.72 21.59,44.2 v2(19.93,45.86) ; U2.16 v2(37.07,30.26)
  Bottom Layer w0.152: v2(19.93,45.86) 29.64,36.15 33.23,36.15 37.07,32.32 v2(37.07,30.26)
ROM_A20: length 28.1
  Top Layer w0.152: 22.65,47.62 22.65,47.61 v2(21.87,46.83) ; U2.9 v2(40.57,33.72)
  Bottom Layer w0.152: v2(21.87,46.83) 31.07,37.63 38.01,37.63 40.57,35.06 v2(40.57,33.72)
ROM_A21: length 29
  Top Layer w0.152: U4.75 22.65,45.22 v2(21.24,46.64) ; U2.10 40.07,33.18
  Bottom Layer w0.152: v2(21.24,46.64) 30.6,37.27 37.81,37.27 40.07,35.01 v2(40.07,33.18)
ROM_A22: length 27.7
  Top Layer w0.152: U2.13 38.57,33.04 38.96,33.42 v2(38.96,33.46) ; U4.73 21.94,44.51 v2(20.81,45.64)
  Bottom Layer w0.152: v2(38.96,33.46) 38.96,35 37.4,36.56 29.89,36.56 v2(20.81,45.64)
ROM_CS: length 46.9
  Top Layer w0.152: 10.7,37.79 8.85,35.94 v2(8.85,35.29) ; U2.26 33.57,19.64 v2(33.57,19.65)
  Bottom Layer w0.152: v2(33.57,19.65) 30.49,19.65 28.1,22.03 21.96,22.03 20.43,20.51 17.74,20.51 16.77,21.47 16.77,24.42 8.85,32.34 v2(8.85,35.29)
RST: length 59.9
  Top Layer w0.152: J1.30 45.67,19.34 v2(40.09,24.93) ; v2(20.62,46.55) 22.3,44.87 22.3,44.86
  Bottom Layer w0.152: v2(40.09,24.93) 40.09,32.14 40.09,32.14 39.46,32.78 39.46,35.06 37.6,36.92 30.26,36.92 v2(20.62,46.55)
TCK: length 13.1
  Top Layer w0.152: v2(2.14,50.99) 2.14,49.46 3.43,48.18
  Bottom Layer w0.152: v2(2.14,50.99) 3.92,50.99 6.89,53.96 XP1.5
TDI: length 10.6
  Top Layer w0.152: U4.23 2.7,49.61 2.7,54.9 4.35,56.55 XP1.3
TDO: length 11.4
  Top Layer w0.152: XP1.2 3.08,56.4 1.59,54.9 1.59,49.31 U4.25
TMS: length 10.5
  Top Layer w0.152: U4.22 3.26,49.75 3.26,54.29 5.65,56.68 5.65,57.72 XP1.4
VMIX: length 7
  Top Layer w0.203: U6.8 6.48,26.16 5.5,25.18 4.22,25.18 ; 4.22,25.18 C1.1 ; 4.22,25.18 4.23,25.17 D2.1
WR: length 80.8
  Top Layer w0.152: v2(9.41,30.77) 30.64,30.77 33.49,27.92 38.67,27.92 39.57,28.83 U2.11 ; v2(5.19,7.76) 5.17,7.73 J1.3 ; v2(6.81,39.57) 7.86,40.62 U4.39
  Top Layer w0.203: v2(5.81,27.61) 5.86,27.66 v2(9.41,27.66)
  Bottom Layer w0.152: v2(5.19,7.76) 7.58,10.14 7.58,25.84 v2(5.81,27.61) 5.81,38.57 v2(6.81,39.57) ; v2(9.41,27.66) v2(9.41,30.77)
$1N4617: length 2.1
  Top Layer w0.203: D2.2 6.2,21.32 R2.2

## Copper pours and planes (outline as drawn; the poured copper is in the pictures)
GND on Top Layer: -2.28,61.55 52.64,61.55 52.64,-3.01 -2.28,-3.01
GND on Bottom Layer: -1.92,61.55 52.33,61.55 52.33,-1.95 -1.92,-1.95

Small or netless copper shapes (teardrops, artwork), in the pictures only: 242 on Top Layer, 97 on Bottom Layer

## Text on the board
Top Silkscreen Layer: TDO | TDI | TMS | TCK | GND | VCC | v1.1 | Designed by mori | NOR FLASH | CPLD | ChisFlash-MBC5
